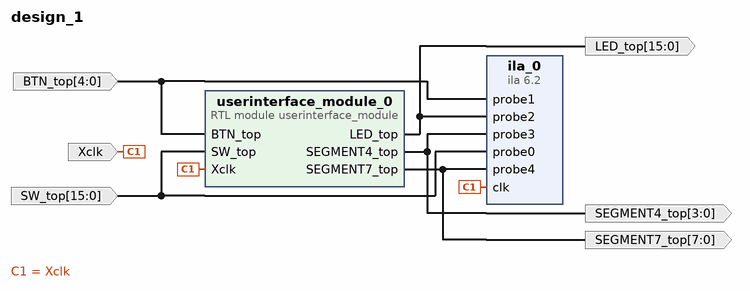
[diagram p0: block diagram of the top level]
# Vivado block design design_1, xc7a35tcpg236-1, Vivado 2020.1
create_bd_design design_1

create_bd_port -dir O -from 15 -to 0 LED_top
create_bd_port -dir O -from 3 -to 0 SEGMENT4_top
create_bd_port -dir O -from 7 -to 0 SEGMENT7_top
create_bd_port -dir I -from 4 -to 0 BTN_top
create_bd_port -dir I -from 15 -to 0 SW_top
create_bd_port -dir I Xclk

create_bd_cell -type ip -vlnv xilinx.com:ip:ila:6.2 ila_0
set_property -dict [list \
  CONFIG.ALL_PROBE_SAME_MU_CNT 2 \
  CONFIG.C_DATA_DEPTH 1024 \
  CONFIG.C_ENABLE_ILA_AXI_MON false \
  CONFIG.C_EN_STRG_QUAL 1 \
  CONFIG.C_MONITOR_TYPE Native \
  CONFIG.C_NUM_OF_PROBES 5 \
  CONFIG.C_PROBE0_MU_CNT 2 \
  CONFIG.C_PROBE0_TYPE 1 \
  CONFIG.C_PROBE0_WIDTH 16 \
  CONFIG.C_PROBE1_MU_CNT 2 \
  CONFIG.C_PROBE1_TYPE 1 \
  CONFIG.C_PROBE1_WIDTH 5 \
  CONFIG.C_PROBE2_MU_CNT 2 \
  CONFIG.C_PROBE2_TYPE 0 \
  CONFIG.C_PROBE2_WIDTH 16 \
  CONFIG.C_PROBE3_MU_CNT 2 \
  CONFIG.C_PROBE3_WIDTH 4 \
  CONFIG.C_PROBE4_MU_CNT 2 \
  CONFIG.C_PROBE4_WIDTH 8 \
  CONFIG.C_TRIGIN_EN false \
  CONFIG.C_TRIGOUT_EN false \
] [get_bd_cells ila_0]
create_bd_cell -type module -reference userinterface_module userinterface_module_0

# ---- connections ----

connect_bd_net [get_bd_ports Xclk] [get_bd_pins ila_0/clk] [get_bd_pins userinterface_module_0/Xclk]
connect_bd_net [get_bd_ports BTN_top] [get_bd_pins ila_0/probe1] [get_bd_pins userinterface_module_0/BTN_top]
connect_bd_net [get_bd_ports SW_top] [get_bd_pins ila_0/probe0] [get_bd_pins userinterface_module_0/SW_top]
connect_bd_net [get_bd_pins userinterface_module_0/LED_top] [get_bd_ports LED_top] [get_bd_pins ila_0/probe2]
connect_bd_net [get_bd_pins userinterface_module_0/SEGMENT4_top] [get_bd_ports SEGMENT4_top] [get_bd_pins ila_0/probe3]
connect_bd_net [get_bd_pins userinterface_module_0/SEGMENT7_top] [get_bd_ports SEGMENT7_top] [get_bd_pins ila_0/probe4]

validate_bd_design
save_bd_design
